# Altium schematic sheet NTC connector.SchDoc
size A3
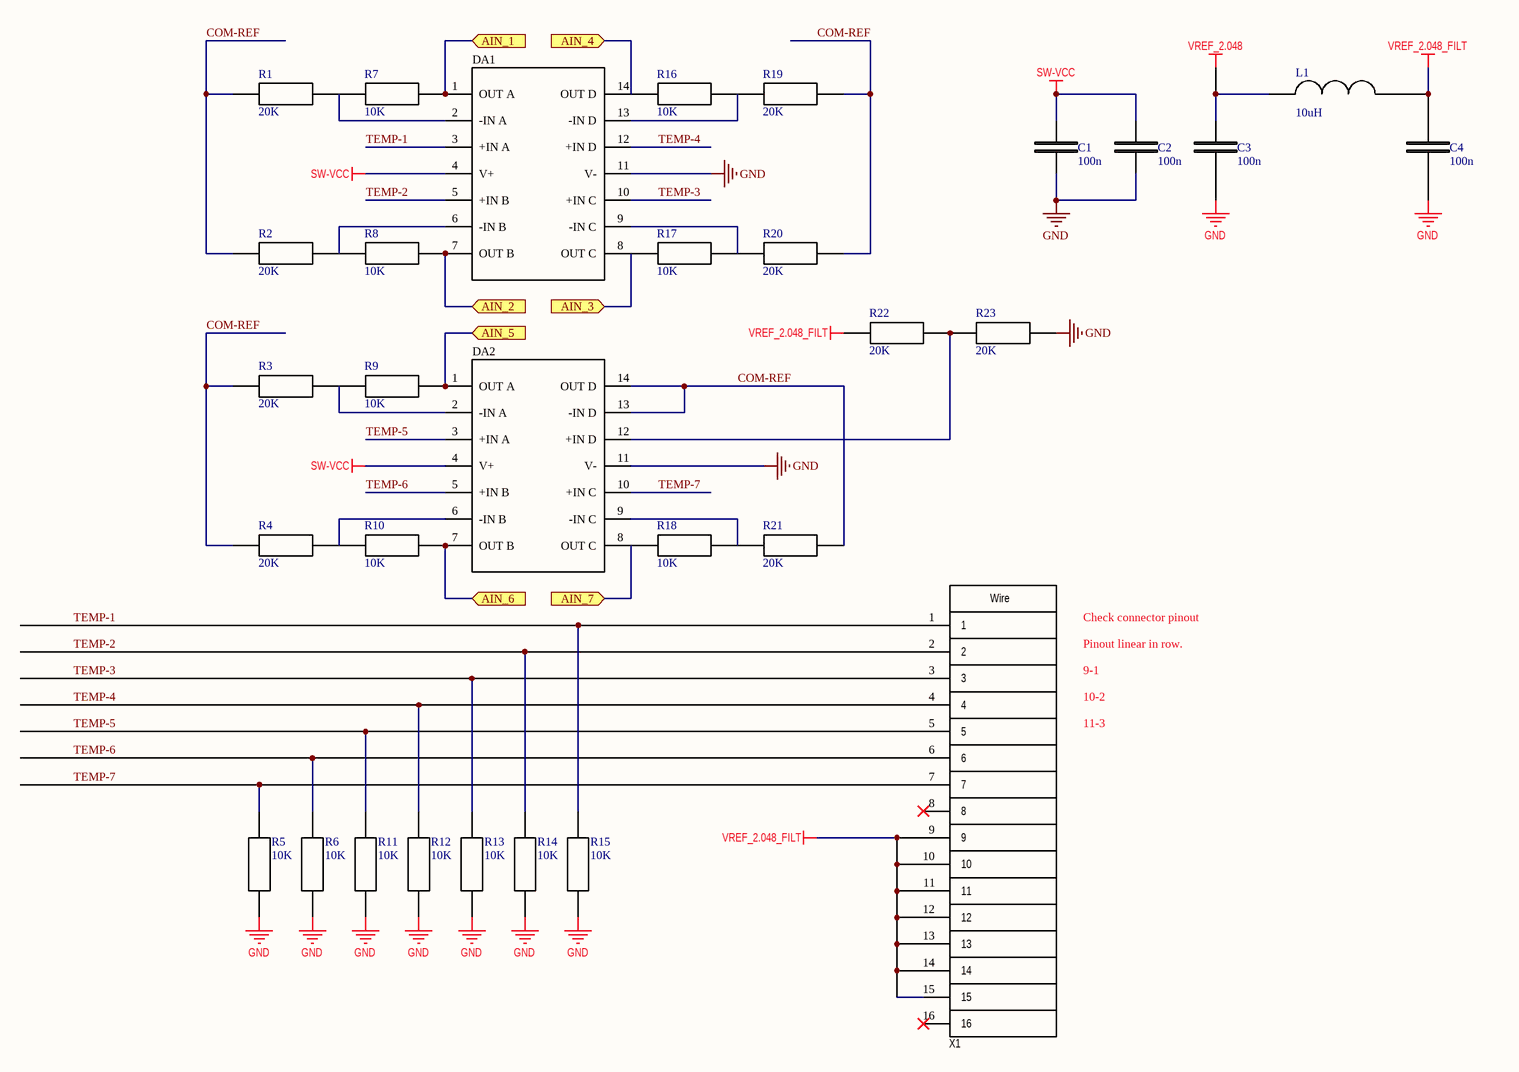
[diagram p0: NTC connector.SchDoc]

## Parts
C1  100n  [CAP0402]
C2  100n  [CAP0402]
C3  100n  [CAP0402]
C4  100n  [CAP0402]
DA1  OPA4376  [TSSOP-14]  (value not drawn)
DA2  OPA4376  [TSSOP-14]  (value not drawn)
L1  10uH  [IND0805]
R1  20K  [RES0402]
R2  20K  [RES0402]
R3  20K  [RES0402]
R4  20K  [RES0402]
R5  10K  [RES0402]
R6  10K  [RES0402]
R7  10K  [RES0402]
R8  10K  [RES0402]
R9  10K  [RES0402]
R10  10K  [RES0402]
R11  10K  [RES0402]
R12  10K  [RES0402]
R13  10K  [RES0402]
R14  10K  [RES0402]
R15  10K  [RES0402]
R16  10K  [RES0402]
R17  10K  [RES0402]
R18  10K  [RES0402]
R19  20K  [RES0402]
R20  20K  [RES0402]
R21  20K  [RES0402]
R22  20K  [RES0402]
R23  20K  [RES0402]
X1  Microfit3.0 16 pins R thru hole  [microfit30_16]  (value not drawn)

## Ports
AIN_1 (in), AIN_2 (in), AIN_3 (in), AIN_4 (in), AIN_5 (in), AIN_6 (in), AIN_7 (in)

## Nets
GND: C1.2 C2.2 C3.2 C4.2 DA1.11(V-) DA2.11(V-) R5.2 R6.2 R11.2 R12.2 R13.2 R14.2 R15.2 R23.2
SW-VCC: C1.1 C2.1 DA1.4(V+) DA2.4(V+)
VREF_2.048: C3.1 L1.1
VREF_2.048_FILT: C4.1 L1.2 R22.1 X1.9 X1.10 X1.11 X1.12 X1.13 X1.14 X1.15
AIN_1: DA1.1(OUT_A) R7.1 ; port AIN_1
AIN_2: DA1.7(OUT_B) R8.1 ; port AIN_2
AIN_3: DA1.8(OUT_C) R17.2 ; port AIN_3
AIN_4: DA1.14(OUT_D) R16.2 ; port AIN_4
AIN_5: DA2.1(OUT_A) R9.1 ; port AIN_5
AIN_6: DA2.7(OUT_B) R10.1 ; port AIN_6
AIN_7: DA2.8(OUT_C) R18.2 ; port AIN_7
COM-REF: DA2.13(-IN_D) DA2.14(OUT_D) R1.2 R2.2 R3.2 R4.2 R19.1 R20.1 R21.1
TEMP-1: DA1.3(+IN_A) R15.1 X1.1
TEMP-2: DA1.5(+IN_B) R14.1 X1.2
TEMP-3: DA1.10(+IN_C) R13.1 X1.3
TEMP-4: DA1.12(+IN_D) R12.1 X1.4
TEMP-5: DA2.3(+IN_A) R11.1 X1.5
TEMP-6: DA2.5(+IN_B) R6.1 X1.6
TEMP-7: DA2.10(+IN_C) R5.1 X1.7
NetDA1_2: DA1.2(-IN_A) R1.1 R7.2
NetDA1_6: DA1.6(-IN_B) R2.1 R8.2
NetDA1_9: DA1.9(-IN_C) R17.1 R20.2
NetDA1_13: DA1.13(-IN_D) R16.1 R19.2
NetDA2_2: DA2.2(-IN_A) R3.1 R9.2
NetDA2_6: DA2.6(-IN_B) R4.1 R10.2
NetDA2_9: DA2.9(-IN_C) R18.1 R21.2
NetDA2_12: DA2.12(+IN_D) R22.2 R23.1

Not connected (* = marked no-connect by the designer): X1 8* 16*

## Notes on the sheet
- Check connector pinout
- Pinout linear in row.
- 9-1
- 10-2
- 11-3
- (in symbol Microfit3.0 16 pins R thru hole) Wire

## Library data of the parts
C1-C4 = 100n SMD 0402: 0402 SMD; PartNumber: CC0402ZRY5V7BB104; Manufacturer: Yageo; Supplier: Terraelectronica; Unit Price: 0.22; WebLink: https://www.terraelectronica.ru/product/543093
DA1 DA2 = OPA4376: Opamp  2.2-5.5 V, Offset 5μV; PartNumber: OPA4376AIPW; Manufacturer: Texas Instruments; WebLink: https://www.terraelectronica.ru/product/349931
L1 = IND 10uH SMD 0805: 0805 SMD; PartNumber: LQM21FN100M80L; Manufacturer: Murata; Supplier: Terraelectronica; Unit Price: 4.4; WebLink: https://www.terraelectronica.ru/product/1496283
R1-R4 R19-R23 = 20K 1% SMD 0402: 1% 0402 SMD 0.063W; PartNumber: RC0402FR-0720KL; Manufacturer: Yageo; Supplier: Terraelectronicac; Unit Price: 0.11; WebLink: https://www.terraelectronica.ru/product/506449
R5-R18 = 10K 1% SMD 0402: 1% 0402 SMD 0.063W; PartNumber: RC0402FR-0710KL; Manufacturer: Yageo; Supplier: Terraelectronica; Unit Price: 0.1; WebLink: https://www.terraelectronica.ru/product/358779
X1 = Microfit3.0 16 pins R thru hole: Step 3mm, dual row 16 pins, thru hole; PartNumber: 43045-1601 molex; Manufacturer: Molex; Supplier: Chipdip; Unit Price: 450; WebLink: https://www.chipdip.ru/product/43045-1601